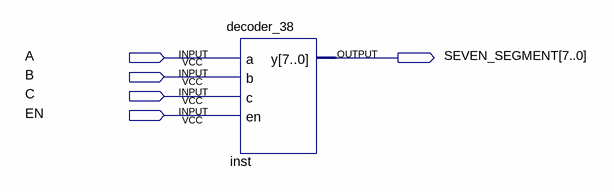
[diagram p0: schematic sheet]
// Quartus schematic test2.bdf as structural Verilog: 1 symbols, 5 pins
module test2 (
  input  A,
  input  B,
  input  C,
  input  EN,
  output [7:0] SEVEN_SEGMENT
);

  decoder_38 inst (.a(A), .b(B), .c(C), .en(EN), .y(SEVEN_SEGMENT));
endmodule
